# Altium schematic sheet wsg1.0.SchDoc
size 297 x 209 mm
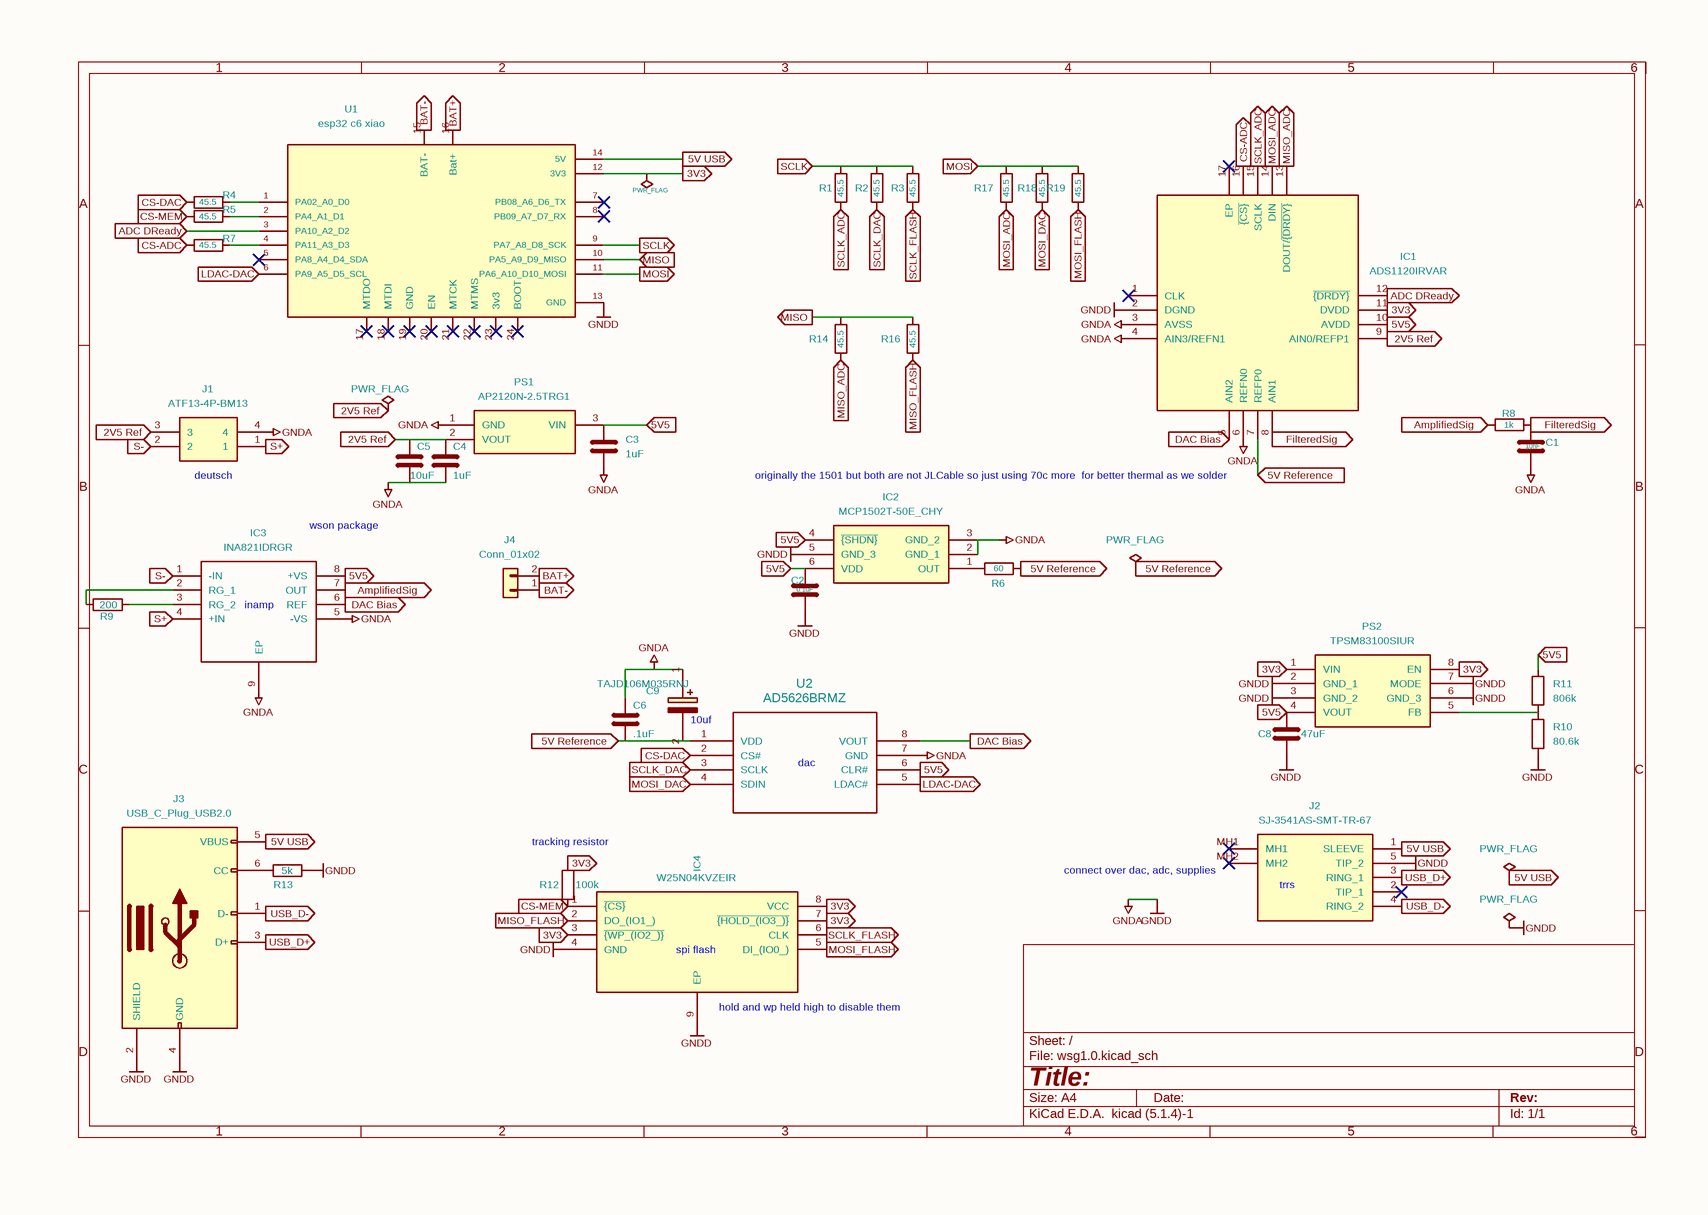
[diagram p0: wsg1.0.SchDoc]

## Parts
#FLG01  PWR_FLAG  (graphical)
#FLG02  PWR_FLAG  (graphical)
#FLG03  PWR_FLAG  (graphical)
#FLG04  PWR_FLAG  (graphical)
#FLG06  PWR_FLAG  (graphical)
C1  10nF  [C_0402_1005Metric]
C2  0.1uF  [C_0402_1005Metric]
C3  1uF  [C_0402_1005Metric]
C4  1uF  [C_0402_1005Metric]
C5  10uF  [C_0402_1005Metric]
C6  .1uF  [C_0402_1005Metric]
C8  47uF  [C_0805_2012Metric]
C9  TAJD106M035RNJ  [CAPPM7344X310N]
IC1  ADS1120IRVAR  [QFN50P350X350X100-17N-D]
IC2  MCP1502T-50E_CHY  [MCP1501-50]
IC3  INA821IDRGR  [SON50P300X300X80-9N-D]
IC4  W25N04KVZEIR  [SON127P800X600X80-9N-D]
J1  ATF13-4P-BM13  [DTF134PG003]
J2  SJ-3541AS-SMT-TR-67  [SJ3541ASSMTTR67]
J3  USB_C_Plug_USB2.0  [USB_C_PLACE]
J4  Conn_01x02  [JST_PH_S2B-PH-K_1x02_P2.00mm_Horizontal]
PS1  AP2120N-2.5TRG1  [SOT91P240X110-3N]
PS2  TPSM83100SIUR  [TPSM83100SIUR]
R1  45.5  [R_0402_1005Metric]
R2  45.5  [R_0402_1005Metric]
R3  45.5  [R_0402_1005Metric]
R4  45.5  [R_0402_1005Metric]
R5  45.5  [R_0402_1005Metric]
R6  60  [R_0603_1608Metric_Pad0.98x0.95mm_HandSolder]
R7  45.5  [R_0402_1005Metric]
R8  1k  [R_0402_1005Metric]
R9  200  [R_0402_1005Metric]
R10  80.6k  [R_0402_1005Metric]
R11  806k  [R_0402_1005Metric]
R12  100k  [R_0402_1005Metric]
R13  5k  [R_0402_1005Metric]
R14  45.5  [R_0402_1005Metric]
R16  45.5  [R_0402_1005Metric]
R17  45.5  [R_0402_1005Metric]
R18  45.5  [R_0402_1005Metric]
R19  45.5  [R_0402_1005Metric]
U1  esp32 c6 xiao  [esp32 c6 smt]
U2  AD5626BRMZ  [AD5626]

## Ports
2V5 Ref (in), 3V3 (in), 3V3 (out), 5V5 (in), 5V5 (out), 5V Reference (in), 5V Reference (out), 5V USB (in), 5V USB (out), ADC DReady (in), ADC DReady (out), AmplifiedSig (in), AmplifiedSig (out), BAT+ (in), BAT+ (out), BAT- (in), BAT- (out), CS-ADC (in), CS-ADC (out), CS-DAC (in), CS-DAC (out), CS-MEM (in), CS-MEM (out), DAC Bias (in), DAC Bias (out), FilteredSig (in), FilteredSig (out), LDAC-DAC (in), LDAC-DAC (out), MISO (in), MISO (out), MISO_ADC (in), MISO_ADC (out), MISO_FLASH (in), MISO_FLASH (out), MOSI (in), MOSI (out), MOSI_ADC (in), MOSI_ADC (out), MOSI_DAC (in), MOSI_DAC (out), MOSI_FLASH (in), MOSI_FLASH (out), S+ (in), S+ (out), S- (in), S- (out), SCLK (in), SCLK (out), SCLK_ADC (in), SCLK_ADC (out), SCLK_DAC (in), SCLK_DAC (out), SCLK_FLASH (in), SCLK_FLASH (out), USB_D+ (in), USB_D+ (out), USB_D- (in), USB_D- (out)

## Nets
GNDA: #FLG04.1(pwr) C1.2 C2.2 C3.2 C4.2 C5.2 C6.1 C8.2 C9.1(+) IC1.2(DGND) IC1.3(AVSS) IC1.4(AIN3/REFN1) IC1.6(REFN0) IC2.2(GND_1) IC2.3(GND_2) IC2.5(GND_3) IC3.5(-VS) IC3.9(EP) IC4.4(GND) IC4.9(EP) J1.4 J2.5(TIP_2) J3.2(SHIELD) J3.4(GND) PS1.1(GND) PS2.2(GND_1) PS2.3(GND_2) PS2.6(GND_3) PS2.7(MODE) R10.1 R13.2 U1.13(GND) U2.7(GND)  [also labelled GNDD]
2V5 Ref: #FLG02.1(pwr) C4.1 C5.1 IC1.9(AIN0/REFP1) J1.3 PS1.2(VOUT) ; port 2V5 Ref
3V3: #FLG01.1(pwr) IC1.11(DVDD) IC4.3(~{{WP_(IO2_)}}) IC4.7(~{{HOLD_(IO3_)}}) IC4.8(VCC) PS2.1(VIN) PS2.8(EN) R12.1 U1.12(3V3) ; port 3V3
5V5: C2.1 C3.1 C8.1 IC1.10(AVDD) IC2.4(~{{SHDN}}) IC2.6(VDD) IC3.8(+VS) PS1.3(VIN) PS2.4(VOUT) R11.2 U2.6(CLR#) ; port 5V5
5V Reference: #FLG06.1(pwr) C6.2 C9.2(-) IC1.7(REFP0) R6.1 U2.1(VDD) ; port 5V Reference
5V USB: #FLG03.1(pwr) J2.1(SLEEVE) J3.5(VBUS) U1.14(5V) ; port 5V USB
ADC DReady: IC1.12(~{{DRDY}}) U1.3(PA10_A2_D2) ; port ADC DReady
AmplifiedSig: IC3.7(OUT) R8.1 ; port AmplifiedSig
BAT+: J4.2(Pin_2) U1.16(Bat+) ; port BAT+
BAT-: J4.1(Pin_1) U1.15(BAT-) ; port BAT-
CS-ADC: IC1.16(~{{CS}}) R7.1 ; port CS-ADC
CS-DAC: R4.1 U2.2(CS#) ; port CS-DAC
CS-MEM: IC4.1(~{{CS}}) R5.1 R12.2 ; port CS-MEM
DAC Bias: IC1.5(AIN2) IC3.6(REF) U2.8(VOUT) ; port DAC Bias
FilteredSig: C1.1 IC1.8(AIN1) R8.2 ; port FilteredSig
LDAC-DAC: U1.6(PA9_A5_D5_SCL) U2.5(LDAC#) ; port LDAC-DAC
MISO: R14.2 R16.2 U1.10(PA5_A9_D9_MISO) ; port MISO
MISO_ADC: IC1.13(DOUT/~{{DRDY}}) R14.1 ; port MISO_ADC
MISO_FLASH: IC4.2(DO_(IO1_)) R16.1 ; port MISO_FLASH
MOSI: R17.2 R18.2 R19.2 U1.11(PA6_A10_D10_MOSI) ; port MOSI
MOSI_ADC: IC1.14(DIN) R17.1 ; port MOSI_ADC
MOSI_DAC: R18.1 U2.4(SDIN) ; port MOSI_DAC
MOSI_FLASH: IC4.5(DI_(IO0_)) R19.1 ; port MOSI_FLASH
S+: IC3.4(+IN) J1.1 ; port S+
S-: IC3.1(-IN) J1.2 ; port S-
SCLK: R1.2 R2.2 R3.2 U1.9(PA7_A8_D8_SCK) ; port SCLK
SCLK_ADC: IC1.15(SCLK) R1.1 ; port SCLK_ADC
SCLK_DAC: R2.1 U2.3(SCLK) ; port SCLK_DAC
SCLK_FLASH: IC4.6(CLK) R3.1 ; port SCLK_FLASH
USB_D+: J2.3(RING_1) J3.3(D+) ; port USB_D+
USB_D-: J2.4(RING_2) J3.1(D-) ; port USB_D-
NetIC2_1: IC2.1(OUT) R6.2
NetIC3_2: IC3.2(RG_1) R9.1
NetIC3_3: IC3.3(RG_2) R9.2
NetJ3_6: J3.6(CC) R13.1
NetPS2_5: PS2.5(FB) R10.2 R11.1
NetR4_2: R4.2 U1.1(PA02_A0_D0)
NetR5_2: R5.2 U1.2(PA4_A1_D1)
NetR7_2: R7.2 U1.4(PA11_A3_D3)

Not connected (* = marked no-connect by the designer): IC1 1(CLK)* 17(EP)*; J2 2(TIP_1)* MH1* MH2*; U1 5(PA8_A4_D4_SDA)* 7(PB08_A6_D6_TX)* 8(PB09_A7_D7_RX)* 17(MTDO)* 18(MTDI)* 19(GND)* 20(EN)* 21(MTCK)* 22(MTMS)* 23(3v3)* 24(BOOT)*

## Notes on the sheet
- (near J1) deutsch
- originally the 1501 but both are not JLCable so just using 70c more
  for better thermal as we solder
- wson package
- (near IC3) inamp
- (near C9) 10uf
- (near U2) dac
- (near R12) tracking resistor
- (near J2) connect over dac, adc,
  supplies
- (near J2) trrs
- (near IC4) spi flash
- (near IC4) hold and wp held high to disable them
- 1
- 2
- 3
- 4
- 5
- 6
- A
- B
- C
- D
- Title:
- File: wsg1.0.kicad_sch
- Sheet: /
- KiCad E.D.A.  kicad (5.1.4)-1
- Size: A4
- Date:
- Rev:
- Id: 1/1

## Library data of the parts
C1-C6 C8 = C
  C1: Value: 10nF; Footprint: Capacitor_SMD:C_0402_1005Metric
  C2: Value: 0.1uF; Footprint: Capacitor_SMD:C_0402_1005Metric
  C3 C4: Value: 1uF; Footprint: Capacitor_SMD:C_0402_1005Metric
  C5: Value: 10uF; Footprint: Capacitor_SMD:C_0402_1005Metric
  C6: Value: .1uF; Footprint: Capacitor_SMD:C_0402_1005Metric
  C8: Value: 47uF; Footprint: Capacitor_SMD:C_0805_2012Metric
C9 = TAJD106M035RNJ: Manufacturer_Name: Kyocera AVX; Height: 3.1; Mouser Part Number: 581-TAJD106M035R; Mouser Price/Stock: https://www.mouser.co.uk/ProductDetail/KYOCERA-AVX/TAJD106M035RNJ?qs=srZBJ3srS4AUaIC0Brj4CQ%3D%3D; Manufacturer_Part_Number: TAJD106M035RNJ; Value: TAJD106M035RNJ; Footprint: 21xt_footprints:CAPPM7344X310N
IC1 = ADS1120IRVAR: Manufacturer_Name: Texas Instruments; Height: 1; Mouser Part Number: 595-ADS1120IRVAR; Mouser Price/Stock: https://www.mouser.co.uk/ProductDetail/Texas-Instruments/ADS1120IRVAR?qs=%2Fd%252BFzHvH4c2AzmjDnnpHRQ%3D%3D; Manufacturer_Part_Number: ADS1120IRVAR; Value: ADS1120IRVAR; Footprint: 21xt_footprints:QFN50P350X350X100-17N-D
IC2 = MCP1501T-50E_CHY: Manufacturer_Name: Microchip; Manufacturer_Part_Number: MCP1501T-50E/CHY; Height: 1.45; Mouser Part Number: 579-MCP1501T-50E/CHY; Mouser Price/Stock: https://www.mouser.co.uk/ProductDetail/Microchip-Technology/MCP1501T-50E-CHY?qs=Li%252BoUPsLEnt6h%2FnXwes%252BxQ%3D%3D; Value: MCP1502T-50E_CHY; Footprint: 21xt_footprints:MCP1501-50
IC3 = INA821IDRGR: Manufacturer_Name: Texas Instruments; Description: Instrumentation Amplifiers High bandwidth (4.7MHz), low noise (7nV/vHz), precision (35 V), low-power, instrumentation amp; Height: 0.8; Mouser Part Number: 595-INA821IDRGR; Mouser Price/Stock: https://www.mouser.co.uk/ProductDetail/Texas-Instruments/INA821IDRGR?qs=LDGDZb5k%2F%252B%2Foo4X%252BEQr4FA%3D%3D; Manufacturer_Part_Number: INA821IDRGR; Value: INA821IDRGR; Footprint: 21xt_footprints:SON50P300X300X80-9N-D
IC4 = W25N04KVZEIR: Manufacturer_Name: Winbond; Height: 0.8; Mouser Part Number: 454-W25N04KVZEIR; Mouser Price/Stock: https://www.mouser.co.uk/ProductDetail/Winbond/W25N04KVZEIR?qs=YwPsRIUVAOdveyibmg1m8Q%3D%3D; Manufacturer_Part_Number: W25N04KVZEIR; Value: W25N04KVZEIR; Footprint: 21xt_footprints:SON127P800X600X80-9N-D
J1 = DTF13-4P-G003: Manufacturer_Name: TE Connectivity; Height: 23.52; Mouser Part Number: 571-DTF13-4P-G003; Mouser Price/Stock: https://www.mouser.co.uk/ProductDetail/TE-Connectivity-DEUTSCH/DTF13-4P-G003?qs=cgQJD%2FpJz0wMj4JqThO4Bw%3D%3D; Manufacturer_Part_Number: DTF13-4P-G003; Value: ATF13-4P-BM13; Footprint: 21xt_footprints:DTF134PG003
J2 = SJ-3541AS-SMT-TR-67: Manufacturer_Name: Same Sky; Height: 5.65; Manufacturer_Part_Number: SJ-3541AS-SMT-TR-67; Arrow Part Number: SJ-3541AS-SMT-TR-67; Arrow Price/Stock: https://www.arrow.com/en/products/sj-3541as-smt-tr-67/cui-devices; Value: SJ-3541AS-SMT-TR-67; Footprint: 21xt_footprints:SJ3541ASSMTTR67
J3 = UCB_C_PLACE: Value: USB_C_Plug_USB2.0; Footprint: 21xt_footprints:USB_C_PLACE
PS1 = AP2120N-5.0TRG1: Manufacturer_Name: Diodes Incorporated; Height: 1.2; Mouser Part Number: 621-AP2120N-5.0TRG1; Mouser Price/Stock: https://www.mouser.co.uk/ProductDetail/Diodes-Incorporated/AP2120N-5.0TRG1?qs=M%2FOdCRO8QQ3JQu49DdtyIA%3D%3D; Manufacturer_Part_Number: AP2120N-5.0TRG1; Value: AP2120N-2.5TRG1; Footprint: 21xt_footprints:SOT91P240X110-3N
PS2 = TPSM83100SIUR: Manufacturer_Name: Texas Instruments; Height: 1.2; Mouser Part Number: 595-TPSM83100SIUR; Mouser Price/Stock: https://www.mouser.co.uk/ProductDetail/Texas-Instruments/TPSM83100SIUR?qs=17ckDYBRdembJwsYYPsw7Q%3D%3D; Manufacturer_Part_Number: TPSM83100SIUR; Value: TPSM83100SIUR; Footprint: 21xt_footprints:TPSM83100SIUR
R1-R14 R16-R19 = R
  R1-R5 R7 R14 R16-R19: Value: 45.5; Footprint: Resistor_SMD:R_0402_1005Metric
  R6: Value: 60; Footprint: Resistor_SMD:R_0603_1608Metric_Pad0.98x0.95mm_HandSolder
  R8: Value: 1k; Footprint: Resistor_SMD:R_0402_1005Metric
  R9: Value: 200; Footprint: Resistor_SMD:R_0402_1005Metric
  R10: Value: 80.6k; Footprint: Resistor_SMD:R_0402_1005Metric
  R11: Value: 806k; Footprint: Resistor_SMD:R_0402_1005Metric
  R12: Value: 100k; Footprint: Resistor_SMD:R_0402_1005Metric
  R13: Value: 5k; Footprint: Resistor_SMD:R_0402_1005Metric
U1 = 102010388: MANUFACTURER: Seeed Technology; Description: \n                        \n                            Seeeduino XIAO Development Board, Pre-Soldered [Seeed Studio] 102010388 Seeeduino XIAO Development Board, Pre-Soldered\n                        \n; MF: Seeed Technology Co., Ltd; MAXIMUM_PACKAGE_HEIGHT: N/A; Package: None; Price: None; Check_prices: https://www.snapeda.com/parts/102010388/Seeed+Studio/view-part/?ref=eda; STANDARD: Manufacturer Recommendations; PARTREV: N/A; SnapEDA_Link: https://www.snapeda.com/parts/102010388/Seeed+Studio/view-part/?ref=snap; MP: 102010388; Availability: In Stock; SNAPEDA_PN: 102010388; Value: esp32 c6 xiao; Footprint: 21xt_footprints:esp32 c6 smt
#FLG01 #FLG02 #FLG03 #FLG04 #FLG06 = PWR_FLAG: Value: PWR_FLAG
J4 = Conn_01x02: Value: Conn_01x02; Footprint: Connector_JST:JST_PH_S2B-PH-K_1x02_P2.00mm_Horizontal
U2 = AD5626BRMZ: Value: AD5626BRMZ; Footprint: 21xt_footprints:AD5626